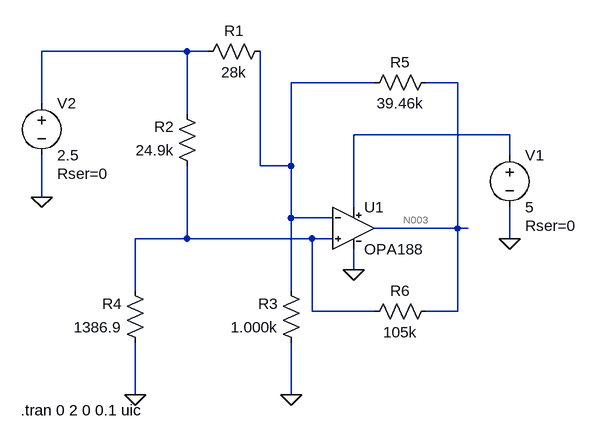
[diagram p0: schematic PT_1000.asc]
PT_1000.asc, the LTspice schematic file:
Version 4
SHEET 1 880 680
WIRE -112 -96 -336 -96
WIRE -80 -96 -112 -96
WIRE 176 -48 48 -48
WIRE 304 -48 256 -48
WIRE -336 -16 -336 -96
WIRE -112 0 -112 -96
WIRE 384 32 144 32
WIRE 384 64 384 32
WIRE 0 80 0 -96
WIRE 48 80 48 -48
WIRE 48 80 0 80
WIRE -336 128 -336 64
WIRE 144 144 144 32
WIRE 48 160 48 80
WIRE 112 160 48 160
WIRE 304 176 304 -48
WIRE 304 176 176 176
WIRE 320 176 304 176
WIRE -112 192 -112 80
WIRE -112 192 -192 192
WIRE 80 192 -112 192
WIRE 112 192 80 192
WIRE 384 192 384 144
WIRE 144 240 144 208
WIRE -192 272 -192 192
WIRE 48 272 48 160
WIRE 80 304 80 192
WIRE 176 304 80 304
WIRE 304 304 304 176
WIRE 304 304 256 304
WIRE -192 432 -192 352
WIRE 48 432 48 352
FLAG 144 240 0
FLAG 384 192 0
FLAG -336 128 0
FLAG -192 432 0
FLAG 48 432 0
SYMBOL OPA188 144 112 R0
SYMATTR InstName U1
SYMBOL voltage 384 48 R0
WINDOW 123 0 0 Left 2
WINDOW 39 24 124 Left 2
SYMATTR SpiceLine Rser=0
SYMATTR InstName V1
SYMATTR Value 5
SYMBOL voltage -336 -32 R0
WINDOW 123 0 0 Left 2
WINDOW 39 24 124 Left 2
SYMATTR SpiceLine Rser=0
SYMATTR InstName V2
SYMATTR Value 2.5
SYMBOL res -96 96 R180
WINDOW 0 36 76 Left 2
WINDOW 3 36 40 Left 2
SYMATTR InstName R2
SYMATTR Value 24.9k
SYMBOL res 64 368 R180
WINDOW 0 36 76 Left 2
WINDOW 3 36 40 Left 2
SYMATTR InstName R3
SYMATTR Value 1.000k
SYMATTR SpiceLine tol=0
SYMBOL res -176 368 R180
WINDOW 0 36 76 Left 2
WINDOW 3 36 40 Left 2
SYMATTR InstName R4
SYMATTR Value 1386.9
SYMATTR SpiceLine tol=0
SYMBOL res 160 -32 R270
WINDOW 0 32 56 VTop 2
WINDOW 3 0 56 VBottom 2
SYMATTR InstName R5
SYMATTR Value 39.46k
SYMBOL res 16 -112 R90
WINDOW 0 0 56 VBottom 2
WINDOW 3 32 56 VTop 2
SYMATTR InstName R1
SYMATTR Value 28k
SYMBOL res 272 288 R90
WINDOW 0 0 56 VBottom 2
WINDOW 3 32 56 VTop 2
SYMATTR InstName R6
SYMATTR Value 105k
TEXT -368 456 Left 2 !.tran 0 2 0 0.1 uic

The netlist it stands for:
* PT_1000.asc
XU1 N005 N002 N004 0 N003 OPA188  ; pins In+ In- V+ V- OUT
V1 N004 0 5 Rser=0
V2 N001 0 2.5 Rser=0
R2 N005 N001 24.9k
R3 0 N002 1.000k tol=0
R4 0 N005 1386.9 tol=0
R5 N002 N003 39.46k
R1 N002 N001 28k
R6 N003 N005 105k
.tran 0 2 0 0.1 uic
.lib OPA188.sub
.backanno
.end

* Results of the author's LTspice run, read from the files saved beside the schematic
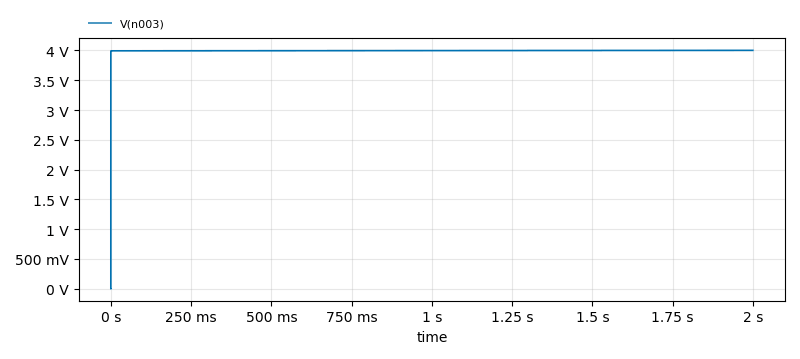
[diagram p1: Transient Analysis of PT_1000.asc, plotted from the saved traces]
* Transient Analysis, 1 run:
*   V(n003): min -529.8 µV, max 4.001 V, average 3.997 V, rms 3.997 V, last 4.001 V